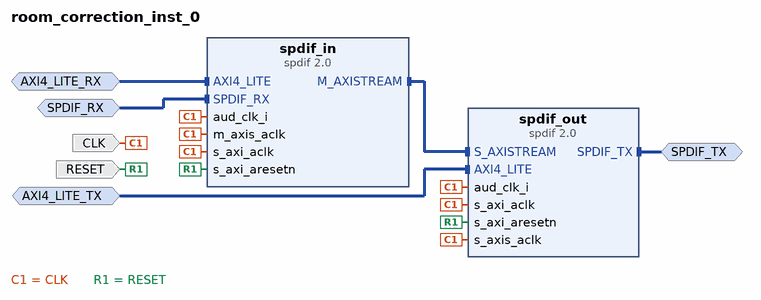
[diagram p0: block diagram of the top level]
# Vivado block design room_correction_inst_0, xc7z020clg400-1, Vivado 2025.1
create_bd_design room_correction_inst_0

create_bd_intf_port -mode Slave -vlnv xilinx.com:interface:aximm_rtl:1.0 AXI4_LITE_RX
create_bd_intf_port -mode Slave -vlnv xilinx.com:interface:aximm_rtl:1.0 AXI4_LITE_TX
create_bd_intf_port -mode Slave -vlnv xilinx.com:interface:spdif_rtl:2.0 SPDIF_RX
create_bd_intf_port -mode Master -vlnv xilinx.com:interface:spdif_rtl:2.0 SPDIF_TX
create_bd_port -dir I -type rst RESET
create_bd_port -dir I -type clk CLK

create_bd_cell -type ip -vlnv xilinx.com:ip:spdif:2.0 spdif_in
set_property -dict {CONFIG.AXI_BUFFER_Size 1024} [get_bd_cells spdif_in]
create_bd_cell -type ip -vlnv xilinx.com:ip:spdif:2.0 spdif_out
set_property -dict [list \
  CONFIG.AXI_BUFFER_Size 1024 \
  CONFIG.CSTATUS_REG 0 \
  CONFIG.FIFO_COUNT 1 \
  CONFIG.SPDIF_Mode 1 \
  CONFIG.USERDATA_REG 0 \
] [get_bd_cells spdif_out]

# ---- connections ----

connect_bd_intf_net -intf_net AXI4_LITE_0_1 [get_bd_intf_ports AXI4_LITE_RX] [get_bd_intf_pins spdif_in/AXI4_LITE]
connect_bd_intf_net -intf_net AXI4_LITE_1_1 [get_bd_intf_ports AXI4_LITE_TX] [get_bd_intf_pins spdif_out/AXI4_LITE]
connect_bd_intf_net -intf_net SPDIF_RX_0_1 [get_bd_intf_ports SPDIF_RX] [get_bd_intf_pins spdif_in/SPDIF_RX]
connect_bd_intf_net [get_bd_intf_pins spdif_in/M_AXISTREAM] [get_bd_intf_pins spdif_out/S_AXISTREAM]
connect_bd_intf_net [get_bd_intf_ports SPDIF_TX] [get_bd_intf_pins spdif_out/SPDIF_TX]
connect_bd_net -net clk_wiz_clk_out1 [get_bd_ports CLK] \
  [get_bd_pins spdif_in/aud_clk_i] [get_bd_pins spdif_out/aud_clk_i] [get_bd_pins spdif_in/s_axi_aclk] \
  [get_bd_pins spdif_out/s_axi_aclk] [get_bd_pins spdif_out/s_axis_aclk] [get_bd_pins spdif_in/m_axis_aclk]
connect_bd_net -net rst_clk_wiz_100M_peripheral_aresetn [get_bd_ports RESET] \
  [get_bd_pins spdif_in/s_axi_aresetn] [get_bd_pins spdif_out/s_axi_aresetn]

# ---- address map ----
assign_bd_address -offset 0x0000 -range 64K -target_address_space [get_bd_addr_spaces AXI4_LITE_RX] [get_bd_addr_segs spdif_in/AXI4_LITE/Reg]
assign_bd_address -offset 0x0000 -range 64K -target_address_space [get_bd_addr_spaces AXI4_LITE_TX] [get_bd_addr_segs spdif_out/AXI4_LITE/Reg]

validate_bd_design
save_bd_design
